# EasyEDA schematic SCH_Astraeus I_2023-09-04.json
TITLE: Astraeus-1; REV: 1.0; Date: 8/27/2023; Sheet: 1/2; Drawn By: Adrien + Michael; Company: Your Company
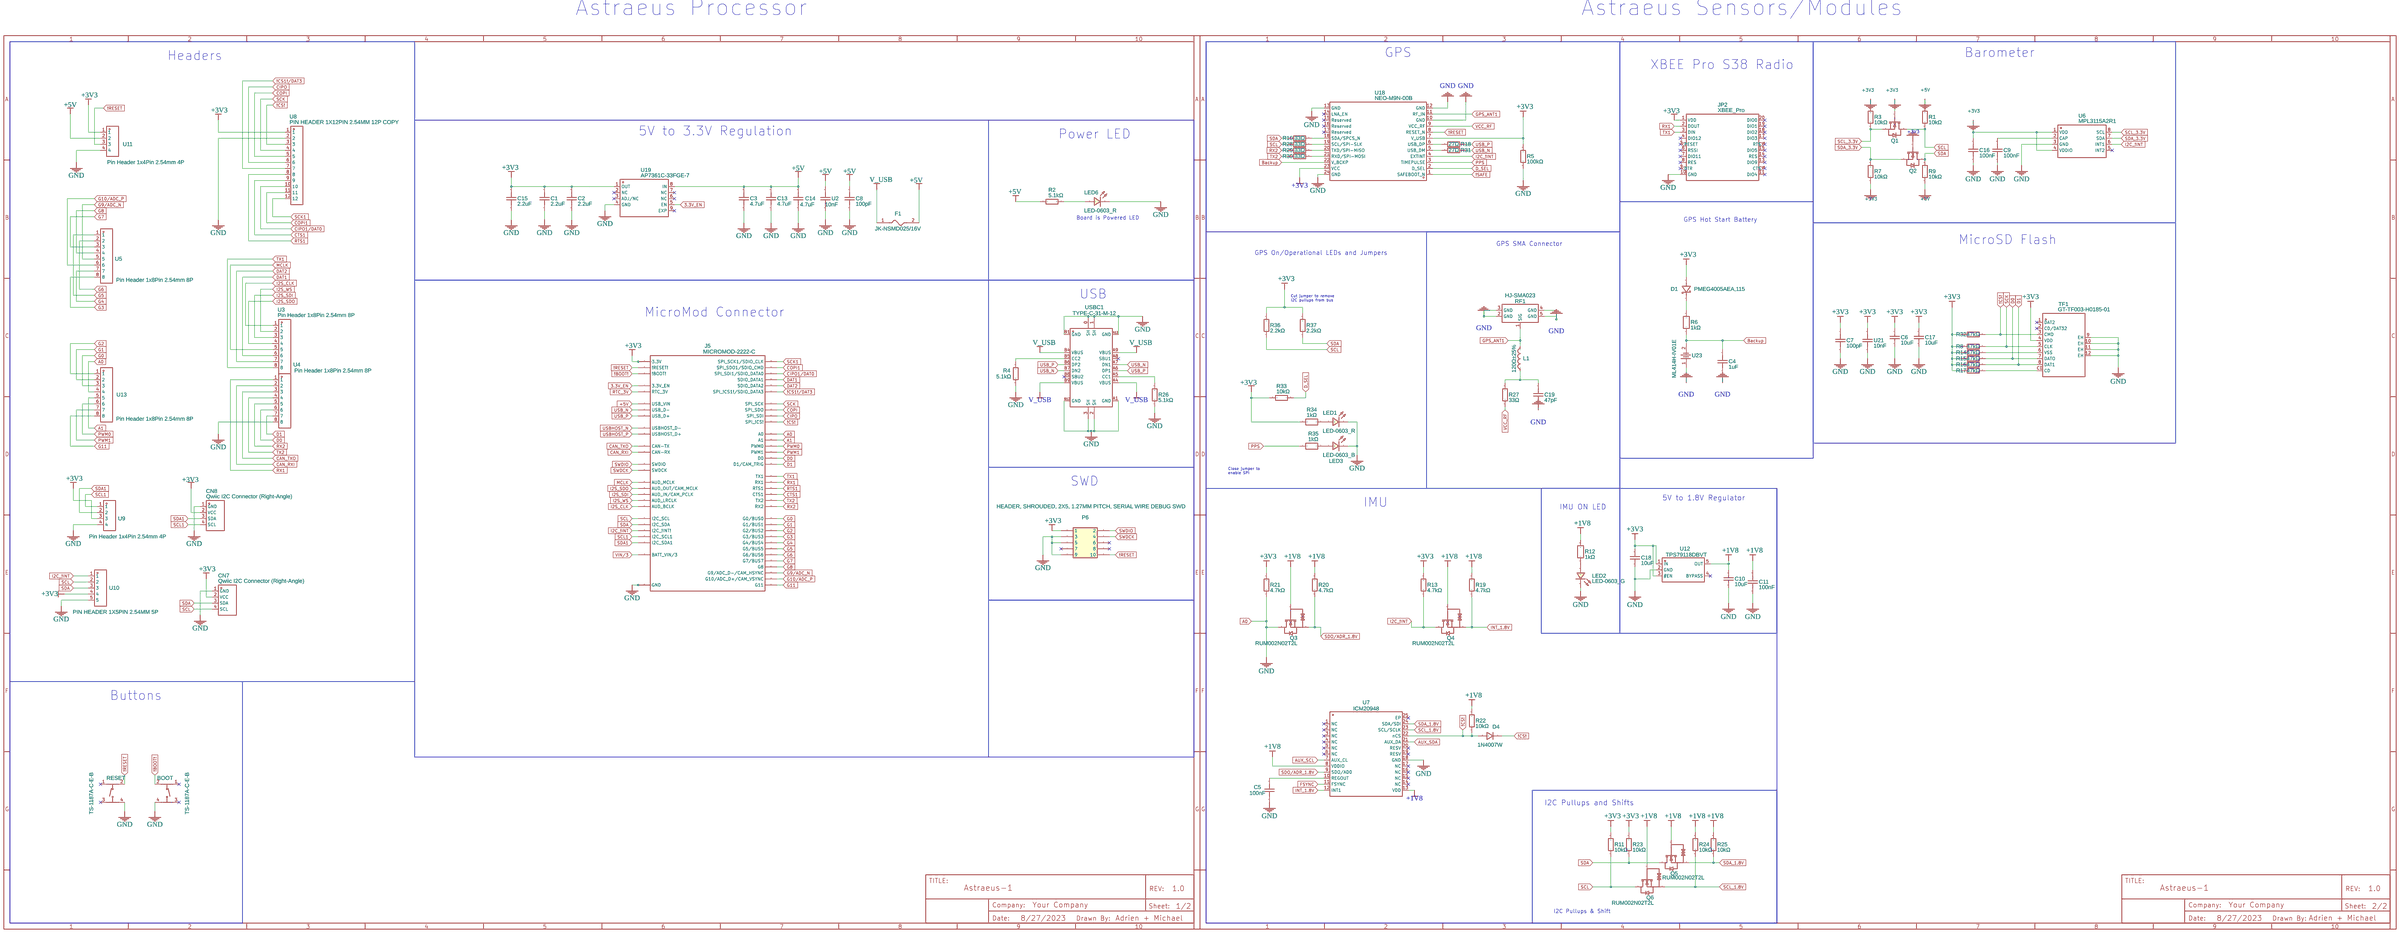
[diagram p0: schematic sheet]

## Parts
BOOT  TS-1187A-C-E-B  [SW-SMD_4P-L5.1-W5.1-P3.70-LS6.5-TL-2]
C1  2.2uF  [C0603]
C2  2.2uF  [C0603]
C3  4.7uF  [C0603]
C4  1uF  [C0603]
C5  100nF  [C0603]
C6  10uF  [C0603]
C7  100pF  [C0603]
C8  100pF  [C0603]
C9  100nF  [C0603]
C10  10uF  [C0603]
C11  100nF  [C0603]
C13  4.7uF  [C0603]
C14  4.7uF  [C0603]
C15  2.2uF  [C0603]
C16  100nF  [C0603]
C17  10uF  [C0603]
C18  10uF  [C0603]
C19  47pF  [C0603]
CN7  Qwiic I2C Connector (Right-Angle)  [QWIIC I2C CONNECTOR (RIGHT-ANGLE)]
CN8  Qwiic I2C Connector (Right-Angle)  [QWIIC I2C CONNECTOR (RIGHT-ANGLE)]
D1  PMEG4005AEA,115  [SOD-323_L1.7-W1.3-LS2.5-RD]
D4  1N4007W  [SOD-123_L2.8-W1.8-LS3.7-RD]
F1  JK-NSMD025/16V  [F1206]
J5  MICROMOD-2222-C  [M.2-CONNECTOR-E]
JP2  XBEE_Pro  [XBEE-PRO-]
L1  120Ω±25%  [L0603]
LED1  LED-0603_R  [LED0603_RED]
LED2  LED-0603_G  [LED0603_GREEN]
LED3  LED-0603_B  [LED0603_BLUE]
LED6  LED-0603_R  [LED0603_RED]
P6  HEADER, SHROUDED, 2X5, 1.27MM PITCH, SERIAL WIRE DEBUG SWD  [HDR-5X2/1.27 SWD]
Q1  BSS138_C489349  [SOT-23-3_L2.9-W1.3-P1.90-LS2.4-BR]
Q2  BSS138_C489349  [SOT-23-3_L2.9-W1.3-P1.90-LS2.4-BR]
Q3  RUM002N02T2L  [SOT-723_L1.2-W0.8-P0.40-LS1.2-BR]
Q4  RUM002N02T2L  [SOT-723_L1.2-W0.8-P0.40-LS1.2-BR]
Q5  RUM002N02T2L  [SOT-723_L1.2-W0.8-P0.40-LS1.2-BR]
Q6  RUM002N02T2L  [SOT-723_L1.2-W0.8-P0.40-LS1.2-BR]
R1  10kΩ  [R0603]
R2  5.1kΩ  [R0603]
R3  10kΩ  [R0603]
R4  5.1kΩ  [R0603]
R5  100kΩ  [R0603]
R6  1kΩ  [R0603]
R7  10kΩ  [R0603]
R8  47kΩ  [R0603]
R9  10kΩ  [R0603]
R10  33Ω  [R0603]
R11  10kΩ  [R0603]
R12  1kΩ  [R0603]
R13  4.7kΩ  [R0603]
R14  47kΩ  [R0603]
R15  47kΩ  [R0603]
R16  47kΩ  [R0603]
R17  47kΩ  [R0603]
R18  27Ω  [R0603]
R19  4.7kΩ  [R0603]
R20  4.7kΩ  [R0603]
R21  4.7kΩ  [R0603]
R22  10kΩ  [R0603]
R23  10kΩ  [R0603]
R24  10kΩ  [R0603]
R25  10kΩ  [R0603]
R26  5.1kΩ  [R0603]
R27  33Ω  [R0603]
R28  33Ω  [R0603]
R29  33Ω  [R0603]
R30  33Ω  [R0603]
R31  27Ω  [R0603]
R32  47kΩ  [R0603]
R33  10kΩ  [R0603]
R34  1kΩ  [R0603]
R35  1kΩ  [R0603]
R36  2.2kΩ  [R0603]
R37  2.2kΩ  [R0603]
RESET  TS-1187A-C-E-B  [SW-SMD_4P-L5.1-W5.1-P3.70-LS6.5-TL-2]
RF1  HJ-SMA023  [SMA-SMD_HJ-SMA023]
TF1  GT-TF003-H0185-01  [TF-SMD_GT-TF003-H0185-01]
U2  10nF  [C0603]
U3  Pin Header 1x8Pin 2.54mm 8P  [PIN HEADER 1X8PIN 2.54MM 8P]
U4  Pin Header 1x8Pin 2.54mm 8P  [PIN HEADER 1X8PIN 2.54MM 8P]
U5  Pin Header 1x8Pin 2.54mm 8P  [PIN HEADER 1X8PIN 2.54MM 8P]
U6  MPL3115A2R1  [SENSORS-SMD_MS5611-01BA03]
U7  ICM20948  [QFN-24_L3.0-W3.0-P0.40-BL-EP]
U8  PIN HEADER 1X12PIN 2.54MM 12P COPY  [PIN HEADER 1X12PIN 2.54MM 12P]
U9  Pin Header 1x4Pin 2.54mm 4P  [PIN HEADER 1X4PIN 2.54MM 4P]
U10  PIN HEADER 1X5PIN 2.54MM 5P  [PIN HEADER 1X5PIN 2.54MM 5P]
U11  Pin Header 1x4Pin 2.54mm 4P  [PIN HEADER 1X4PIN 2.54MM 4P]
U12  TPS79118DBVT  [SOT-23-5_L2.9-W1.6-P0.95-LS2.8-BL]
U13  Pin Header 1x8Pin 2.54mm 8P  [PIN HEADER 1X8PIN 2.54MM 8P]
U18  NEO-M9N-00B  [GPSM-SMD_24P-L16.0-W12.2-P1.10-BL]
U19  AP7361C-33FGE-7  [DFN-8_L3.0-W3.0-P0.65-BL-EP]
U21  10nF  [C0603]
U23  ML414H-IV01E  [BAT-SMD_ML414H-IV01E]
USBC1  TYPE-C-31-M-12  [USB-C_SMD-TYPE-C-31-M-12]

## Library data of the parts
BOOT RESET = TS-1187A-C-E-B: Contributor: LCSC; Supplier: LCSC; Supplier Part: C318887; Manufacturer: XKB Connectivity(中国星坤); JLCPCB Part Class: Extended Part; link: https://lcsc.com/eda_search?q=C318887&%26type=1&ref=editor
C1 C2 C15 = TCC0603X5R225K250CT: Contributor: LCSC; Supplier: LCSC; Supplier Part: C380321; Manufacturer: CCTC(三环); JLCPCB Part Class: Extended Part; link: https://lcsc.com/eda_search?q=C380321&%26type=1&ref=editor
C3 C13 C14 = V475K0603X7R6R3NET: Contributor: lcsc; Supplier: LCSC; Supplier Part: C2976057; Manufacturer: VIIYONG(微容); JLCPCB Part Class: Extended Part; link: https://lcsc.com/eda_search?q=C2976057&%26type=1&ref=editor
C4 = 0603X105J160CT: Contributor: LCSC; Supplier: LCSC; Supplier Part: C458913; Manufacturer: Walsin(华新科); JLCPCB Part Class: Extended Part; link: https://lcsc.com/eda_search?q=C458913&%26type=1&ref=editor
C5 C9 C11 C16 = 0603ZC104KAT2A: Contributor: LCSC; Supplier: LCSC; Supplier Part: C597251; Manufacturer: Kyocera AVX; JLCPCB Part Class: Extended Part; link: https://lcsc.com/eda_search?q=C597251&%26type=1&ref=editor
C6 C10 C17 C18 = CC0603MRX5R7BB106: Supplier: LCSC; Manufacturer: YAGEO(国巨); Supplier Part: C109457; JLCPCB Part Class: Extended Part; link: https://lcsc.com/eda_search?q=C109457&%26type=1&ref=editor
C7 C8 = TCC0603COG101J500CT: Contributor: LCSC; Supplier: LCSC; Supplier Part: C344186; Manufacturer: CCTC(三环); JLCPCB Part Class: Extended Part; link: https://lcsc.com/eda_search?q=C344186&%26type=1&ref=editor
C19 = 0603CG470G500NT: Contributor: LCSC; Supplier: LCSC; Supplier Part: C302038; Manufacturer: FH(风华); JLCPCB Part Class: Extended Part; link: https://lcsc.com/eda_search?q=C302038&%26type=1&ref=editor
CN7 CN8 = Qwiic I2C Connector (Right-Angle): Contributor: ammonytesystems
D1 = PMEG4005AEA,115: Contributor: LCSC; Supplier: LCSC; Supplier Part: C426867; Manufacturer: Nexperia(安世); JLCPCB Part Class: Extended Part; link: https://lcsc.com/eda_search?q=C426867&%26type=1&ref=editor
D4 = 1N4007W: Supplier: LCSC; Supplier Part: C328592; Manufacturer: BLUE ROCKET; Contributor: LCEDA_Lib
F1 = JK-NSMD025/16V: Contributor: LCSC; Supplier: LCSC; Supplier Part: C2830238; Manufacturer: JK(金科); Manufacturer Part: JK-nSMD025/16V; JLCPCB Part Class: Extended Part; link: https://lcsc.com/eda_search?q=C2830238&%26type=1&ref=editor
J5 = MICROMOD-2222-C: Contributor: charlescarver
JP2 = XBEE_Pro: Digi XBee and XBee Pro; Contributor: Dev 91
L1 = BLM18KG121TN1D: Supplier: LCSC; Manufacturer: muRata(村田); Supplier Part: C85831; JLCPCB Part Class: Extended Part; link: https://lcsc.com/eda_search?q=C85831&%26type=1&ref=editor
LED1 LED6 = LED-0603_R: Manufacturer: EVERLIGHT(台湾亿光); Manufacturer Part: 19-217/R6C-AL1M2VY/3T; Supplier Part: C72044; Supplier: LCSC; Contributor: LCEDA_01
LED2 = LED-0603_G: Manufacturer: EVERLIGHT(台湾亿光); Manufacturer Part: 19-217/GHC-YR1S2/3T; Supplier Part: C72043; Supplier: LCSC; Contributor: LCEDA_Lib
LED3 = LED-0603_B: Manufacturer: EVERLIGHT(台湾亿光); Manufacturer Part: 19-217/BHC-ZL1M2RY/3T; Supplier Part: C72041; Supplier: LCSC; Contributor: LCEDA_01
P6 = HEADER, SHROUDED, 2X5, 1.27MM PITCH, SERIAL WIRE DEBUG SWD: Supplier: Digi-Key; Manufacturer: CNC Tech; Manufacturer Part: 3220-10-0100-00; Supplier Part: 1175-1627-ND
Q1 Q2 = BSS138_C489349: Contributor: LCSC; Supplier: LCSC; Supplier Part: C489349; Manufacturer: KEXIN(科信); Manufacturer Part: BSS138; JLCPCB Part Class: Extended Part; link: https://lcsc.com/eda_search?q=C489349&%26type=1&ref=editor
Q3-Q6 = RUM002N02T2L: Contributor: LCSC; Supplier: LCSC; Supplier Part: C250130; Manufacturer: ROHM(罗姆); JLCPCB Part Class: Extended Part; link: https://lcsc.com/eda_search?q=C250130&%26type=1&ref=editor
R1 R3 R7 R9 R11 R22-R25 R33 = RMC060310K5%N: Contributor: LCSC; Supplier: LCSC; Supplier Part: C269684; Manufacturer: Tyohm(幸亚电阻); JLCPCB Part Class: Extended Part; link: https://lcsc.com/eda_search?q=C269684&%26type=1&ref=editor
R2 R4 R26 = RMC06035.1K5%N: Contributor: LCSC; Supplier: LCSC; Supplier Part: C269696; Manufacturer: Tyohm(幸亚电阻); JLCPCB Part Class: Extended Part; link: https://lcsc.com/eda_search?q=C269696&%26type=1&ref=editor
R5 = RT0603DRE07100KL: Contributor: LCSC; Supplier: LCSC; Supplier Part: C327122; Manufacturer: YAGEO(国巨); JLCPCB Part Class: Extended Part; link: https://lcsc.com/eda_search?q=C327122&%26type=1&ref=editor
R6 R12 R34 R35 = SCR0603J1K: Contributor: lcsc; Supplier: LCSC; Supplier Part: C3017736; Manufacturer: VO(翔胜); JLCPCB Part Class: Extended Part; link: https://lcsc.com/eda_search?q=C3017736&%26type=1&ref=editor
R8 R14-R17 R32 = CR0603-FX-4702ELF: Contributor: LCSC; Supplier: LCSC; Supplier Part: C203628; Manufacturer: BOURNS; JLCPCB Part Class: Extended Part; link: https://lcsc.com/eda_search?q=C203628&%26type=1&ref=editor
R10 R27-R30 = RC0603FR-0733RL: Supplier: LCSC; Manufacturer: YAGEO(国巨); Supplier Part: C108661; JLCPCB Part Class: Extended Part; link: https://lcsc.com/eda_search?q=C108661&%26type=1&ref=editor
R13 R19-R21 = RMC06034.7K1%N: Contributor: LCSC; Supplier: LCSC; Supplier Part: C269713; Manufacturer: Tyohm(幸亚电阻); Manufacturer Part: RMC06034K7FN; JLCPCB Part Class: Extended Part; link: https://lcsc.com/eda_search?q=C269713&%26type=1&ref=editor
R18 R31 = CR0603FA27R0G: Supplier: LCSC; Manufacturer: LIZ(丽智电子); Supplier Part: C100925; JLCPCB Part Class: Extended Part; link: https://lcsc.com/eda_search?q=C100925&%26type=1&ref=editor
R36 R37 = RMC06032.2K5%N: Contributor: LCSC; Supplier: LCSC; Supplier Part: C325643; Manufacturer: Tyohm(幸亚电阻); JLCPCB Part Class: Extended Part; link: https://lcsc.com/eda_search?q=C325643&%26type=1&ref=editor
RF1 = HJ-SMA023: Contributor: LCSC; Supplier: LCSC; Supplier Part: C1509219; Manufacturer: 皇捷; JLCPCB Part Class: Extended Part; link: https://lcsc.com/eda_search?q=C1509219&%26type=1&ref=editor
TF1 = GT-TF003-H0185-01: Supplier: LCSC; Supplier Part: C5155563; Manufacturer: G-Switch(品赞); JLCPCB Part Class: Extended Part; Contributor: lcsc; link: https://lcsc.com/eda_search?q=C5155563&%26type=1&ref=editor
U2 U21 = AC0603KRX7R7BB103: Contributor: lcsc; Supplier: LCSC; Supplier Part: C149619; Manufacturer: YAGEO(国巨); JLCPCB Part Class: Extended Part; link: https://lcsc.com/eda_search?q=C149619&%26type=1&ref=editor
U3-U5 U13 = Pin Header 1x8Pin 2.54mm 8P: Contributor: FirstZ Kai Zen
U6 = MPL3115A2R1: Supplier: LCSC; Manufacturer: NXP(恩智浦); Supplier Part: C54429; JLCPCB Part Class: Extended Part; link: https://lcsc.com/eda_search?q=C54429&%26type=1&ref=editor
U7 = ICM20948: Contributor: lcsc; Supplier: LCSC; Supplier Part: C2683596; Manufacturer: null; JLCPCB Part Class: Extended Part; link: https://lcsc.com/eda_search?q=C2683596&%26type=1&ref=editor
U8 = PIN HEADER 1X12PIN 2.54MM 12P COPY: Contributor: FirstZ Kai Zen
U9 U11 = Pin Header 1x4Pin 2.54mm 4P: Contributor: dridriswim
U10 = PIN HEADER 1X5PIN 2.54MM 5P COPY: Contributor: dridriswim
U12 = TPS79118DBVT: Contributor: LCSC; Supplier: LCSC; Supplier Part: C202193; Manufacturer: TI(德州仪器); JLCPCB Part Class: Extended Part; link: https://lcsc.com/eda_search?q=C202193&%26type=1&ref=editor
U18 = NEO-M9N-00B: Contributor: lcsc; Supplier: LCSC; Supplier Part: C5119087; Manufacturer: null; JLCPCB Part Class: Extended Part; link: https://lcsc.com/eda_search?q=C5119087&%26type=1&ref=editor
U19 = AP7361C-33FGE-7: Contributor: LCSC; Supplier: LCSC; Manufacturer: DIODES(美台); Supplier Part: C151007; JLCPCB Part Class: Extended Part; link: https://lcsc.com/eda_search?q=C151007&%26type=1&ref=editor
U23 = ML414H-IV01E: Contributor: LCSC; Supplier: LCSC; Supplier Part: C167511; Manufacturer: Seiko(精工); JLCPCB Part Class: Extended Part; link: https://lcsc.com/eda_search?q=C167511&%26type=1&ref=editor
USBC1 = TYPE-C-31-M-12: Contributor: LCSC; Supplier: LCSC; Supplier Part: C165948; Manufacturer: 韩国韩荣; JLCPCB Part Class: Extended Part; link: https://lcsc.com/eda_search?q=C165948&%26type=1&ref=editor

## Nets
3.3V_EN: J5.4(3.3V_EN) U19.5(EN)
+1V8: C10.2 C11.2 Q3.1(G) Q4.1(G) Q5.1(G) Q6.1(G) R12.2 R19.2 R20.2 R22.2 R24.2 R25.2 U7.8(VDDIO) U7.13(VDD) U12.5(OUT)
+3V3: C1.2 C2.2 C6.2 C7.1 C15.2 C16.2 C17.2 C18.2 CN7.2(VCC) CN8.2(VCC) D1.2 J5.2(3.3V) J5.74(3.3V) JP2.1(VDD) P6.1 Q1.1(G) Q2.1(G) R3.2 R5.2 R7.1 R8.1 R11.2 R13.2 R14.1 R15.1 R16.1 R17.1 R21.2 R23.2 R32.1 R33.2 R34.2 R36.2 R37.2 TF1.4(VDD) U6.1(VDD) U6.4(VDDIO) U8.1 U9.3 U10.4 U11.1 U12.1(IN) U12.3(#EN) U18.7(V_USB) U18.23(VCC) U19.1(OUT) U21.2
+5V: C3.2 C8.1 C13.2 C14.2 F1.2 J5.9(USB_VIN) R1.2 R2.1 R9.1 U2.2 U11.2 U19.8(IN)
VCC_RF: R27.1 U18.9(VCC_RF)
!BOOT!: BOOT.2(B) J5.11(!BOOT!)
!CS1!/DAT3: J5.70(SPI_!CS1!/SDIO_DATA3) U8.7
!CS!: D4.1 D4.2 J5.55(SPI_!CS!) R22.1 R32.2 TF1.3(CMD) U7.22(nCS) U8.3
!RESET: J5.6(!RESET!) P6.10 RESET.2(B) U11.3 U18.8(RESET_N)
!SAFE: U18.1(SAFEBOOT_N)
A0: BOOT.4(D) C1.1 C2.1 C3.1 C4.1 C5.1 C6.1 C7.2 C8.2 C9.1 C10.1 C11.1 C13.1 C14.1 C15.1 C16.1 C17.1 C18.1 C19.2 CN7.1(GND) CN8.1(GND) J5.1(GND) J5.7(GND) J5.33(GND) J5.34(A0) J5.36(GND) J5.39(GND) J5.45(GND) J5.75(GND) JP2.10(GND) LED1.2 LED2.2 LED3.2 LED6.2 P6.3 P6.5 P6.9 Q3.3(D) R4.2 R5.1 R21.1 R26.1 RESET.4(D) RF1.2(GND) RF1.3(GND) RF1.4(GND) RF1.5(GND) TF1.9(EH) TF1.10(EH) TF1.11(EH) TF1.12(EH) U2.1 U4.8 U6.3(GND) U7.18(GND) U8.2 U9.4 U10.5 U11.4 U12.2(GND) U13.4 U18.10(GND) U18.12(GND) U18.13(GND) U18.24(GND) U19.4(GND) U21.1 U23.1 USBC1.0(SH) USBC1.1(SH) USBC1.2(SH) USBC1.3(SH) USBC1.A1(GND) USBC1.A12(GND) USBC1.B1(GND) USBC1.B12(GND)
A1: J5.38(A1) U13.5
AUX_SCL: U7.7(AUX_CL)
AUX_SDA: U7.21(AUX_DA)
Backup: C4.2 R6.1 U18.22(V_BCKP) U23.2
CAN_RXI: J5.41(CAN-RX) U4.2
CAN_TXO: J5.43(CAN-TX) U4.3
CIPO: J5.61(SPI_SDI) U8.6
CIPO1/DAT0: J5.64(SPI_SDI1/SDIO_DATA0) U8.10
COPI: J5.59(SPI_SDO) U8.5
COPI1: J5.62(SPI_SDO1/SDIO_CMD) U8.11
CTS1: J5.15(CTS1) U8.9
D0: J5.10(D0) R15.2 TF1.7(DATO) U4.6
D1: J5.18(D1/CAM_TRIG) R16.2 TF1.8(DAT1) U4.7
D_SEL: R33.1 U18.2(D_SEL)
DAT1: J5.66(SDIO_DATA1) U3.6
DAT2: J5.68(SDIO_DATA2) U3.7
FSYNC: U7.11(FSYNC)
G0: J5.40(G0/BUS0) U13.3
G1: J5.42(G1/BUS1) U13.2
G2: J5.44(G2/BUS2) U13.1
G3: J5.46(G3/BUS3) U5.8
G4: J5.48(G4/BUS4) U5.7
G5: J5.73(G5/BUS5) U5.1
G6: J5.71(G6/BUS6) U5.2
G7: J5.69(G7/BUS7) U5.3
G8: J5.67(G8) U5.4
G9/ADC_N: J5.65(G9/ADC_D-/CAM_HSYNC) U5.5
G10/ADC_P: J5.63(G10/ADC_D+/CAM_VSYNC) U5.6
G11: J5.8(G11) U13.8
GPS_ANT1: L1.2 RF1.1(SIG) U18.11(RF_IN)
I2C_!INT: J5.16(I2C_!INT!) Q4.3(D) R13.1 U6.6(INT1) U10.1 U18.4(EXTINT)
I2S_CLK: J5.50(AUD_BCLK) U3.1
I2S_SDI: J5.54(AUD_IN/CAM_PCLK) U3.3
I2S_SDO: J5.56(AUD_OUT/CAM_MCLK) U3.4
I2S_WS: J5.52(AUD_LRCLK) U3.2
INT_1.8V: Q4.2(S) R19.1 U7.12(INT1)
MCLK: J5.58(AUD_MCLK) U3.5
PPS: R35.1 U18.3(TIMEPULSE)
PWM0: J5.32(PWM0) U13.6
PWM1: J5.47(PWM1) U13.7
RTC_3V: J5.72(RTC_3V)
RTS1: J5.13(RTS1) U8.8
RX1: J5.19(RX1) JP2.2(DOUT) U4.1
RX2: J5.20(RX2) R29.2 U4.5
SCK: J5.57(SPI_SCK) R8.2 TF1.5(CLK) U8.4
SCK1: J5.60(SPI_SCK1/SDIO_CLK) U8.12
SCL: CN7.4(SCL) J5.14(I2C_SCL) Q1.3(D) Q6.3(D) R1.1 R11.1 R28.2 R36.1 U10.2
SCL1: CN8.4(SCL) J5.53(I2C_SCL1) U9.1
SCL_1.8V: Q6.2(S) R24.1 U7.23(SCL/SCLK)
SCL_3.3V: Q1.2(S) R3.1 U6.8(SCL)
SDA: CN7.3(SDA) J5.12(I2C_SDA) Q2.3(D) Q5.3(D) R9.2 R10.1 R23.1 R37.1 U10.3
SDA1: CN8.3(SDA) J5.51(I2C_SDA1) U9.2
SDA_1.8V: Q5.2(S) R25.1 U7.24(SDA/SDI)
SDA_3.3V: Q2.2(S) R7.2 U6.7(SDA)
SDO/ADR_1.8V: Q3.2(S) R20.1 U7.9(SDO/AD0)
SWDCK: J5.21(SWDCK) P6.4
SWDIO: J5.23(SWDIO) P6.2
TX1: J5.17(TX1) JP2.3(DIN) U3.8
TX2: J5.22(TX2) R30.2 U4.4
USB_N: J5.5(USB_D-) R31.2 USBC1.A7(DN1) USBC1.B7(DN2)
USB_P: J5.3(USB_D+) R18.2 USBC1.A6(DP1) USBC1.B6(DP2)
USBHOST_N: J5.37(USBHOST_D-)
USBHOST_P: J5.35(USBHOST_D+)
V_USB: F1.1 USBC1.A4(VBUS) USBC1.A9(VBUS) USBC1.B4(VBUS) USBC1.B9(VBUS)
VIN/3: J5.49(BATT_VIN/3)
Net-(C5-2): C5.2 U7.10(REGOUT)
Net-(C9-2): C9.2 U6.2(CAP)
Net-(C19-1): C19.1 L1.1 R27.2
Net-(D1-1): D1.1 R6.2
Net-(LED1-1): LED1.1 R34.1
Net-(LED2-1): LED2.1 R12.1
Net-(LED3-1): LED3.1 R35.2
Net-(LED6-1): LED6.1 R2.2
Net-(R4-1): R4.1 USBC1.B5(CC2)
Net-(R10-2): R10.2 U18.18(SDA/SPCS_N)
Net-(R14-2): R14.2 TF1.6(VSS)
Net-(R17-2): R17.2 TF1.CD
Net-(R18-1): R18.1 U18.6(USB_DP)
Net-(R26-2): R26.2 USBC1.A5(CC1)
Net-(R28-1): R28.1 U18.19(SCL/SPI-SLK)
Net-(R29-1): R29.1 U18.20(TXD/SPI-MISO)
Net-(R30-1): R30.1 U18.21(RXD/SPI-MOSI)
Net-(R31-1): R31.1 U18.5(USB_DM)

Not connected (* = marked no-connect by the designer): BOOT 1(A)* 3(C)*; JP2 4(DIO12)* 5(RESET)* 6(RSSI)* 7(DIO11)* 8(RES)* 9(DTR)* 11(DIO4)* 12(CTS)* 13(DIO9)* 14(RES)* 15(DIO5)* 16(RTS)* 17(DIO3)* 18(DIO2)* 19(DIO1)* 20(DIO0)*; P6 6* 7* 8*; RESET 1(A)* 3(C)*; TF1 1(DAT2)* 2(CD/DAT32)*; U6 5(INT2)*; U7 1(NC)* 2(NC)* 3(NC)* 4(NC)* 5(NC)* 6(NC)* 14(NC)* 15(NC)* 16(NC)* 17(NC)* 19(RESV)* 20(RESV)* 25(EP)*; U12 4(BYPASS)*; U18 14(LNA_EN)* 15(Reserved)* 16(Reserved)* 17(Reserved)*; U19 2(NC)* 3(ADJ/NC)* 6(NC)* 7(NC)* 9(EXP)*; USBC1 A8(SBU1)* B8(SBU2)*

## Notes on the sheet
- Astraeus Processor
- Astraeus Sensors/Modules
- Headers
- GPS
- Barometer
- XBEE Pro S38 Radio
- 5V to 3.3V Regulation
- Power LED
- Board is Powered LED
- GPS Hot Start Battery
- MicroSD Flash
- GPS SMA Connector
- GPS On/Operational LEDs and Jumpers
- USB
- Cut jumper to remove
  I2C pullups from bus
- MicroMod Connector
- Close jumper to
  enable SPI
- SWD
- 5V to 1.8V Regulator
- IMU
- IMU ON LED
- Buttons
- I2C Pullups and Shifts
- I2C Pullups & Shift
